# EAGLE board atmega_fusebit_doctor_V2_Custom_7 (EAGLE 8.5.1)
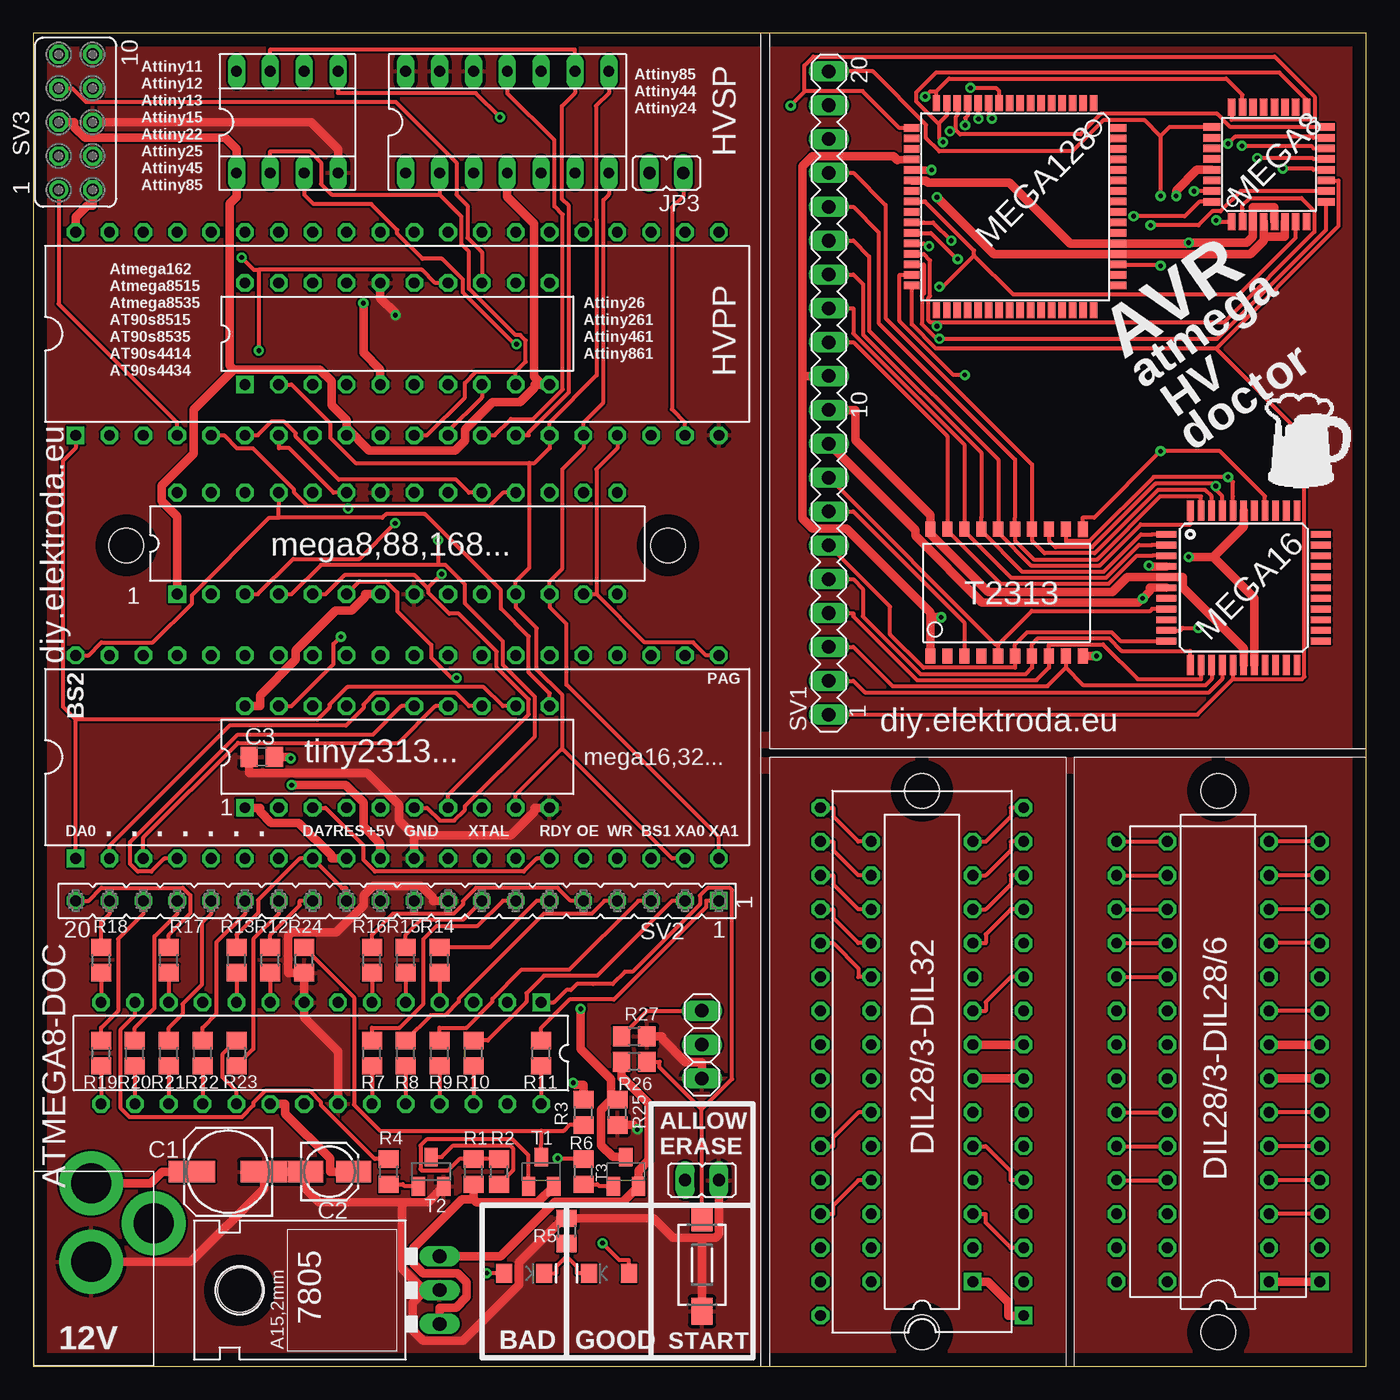
[diagram p3: board, top side]
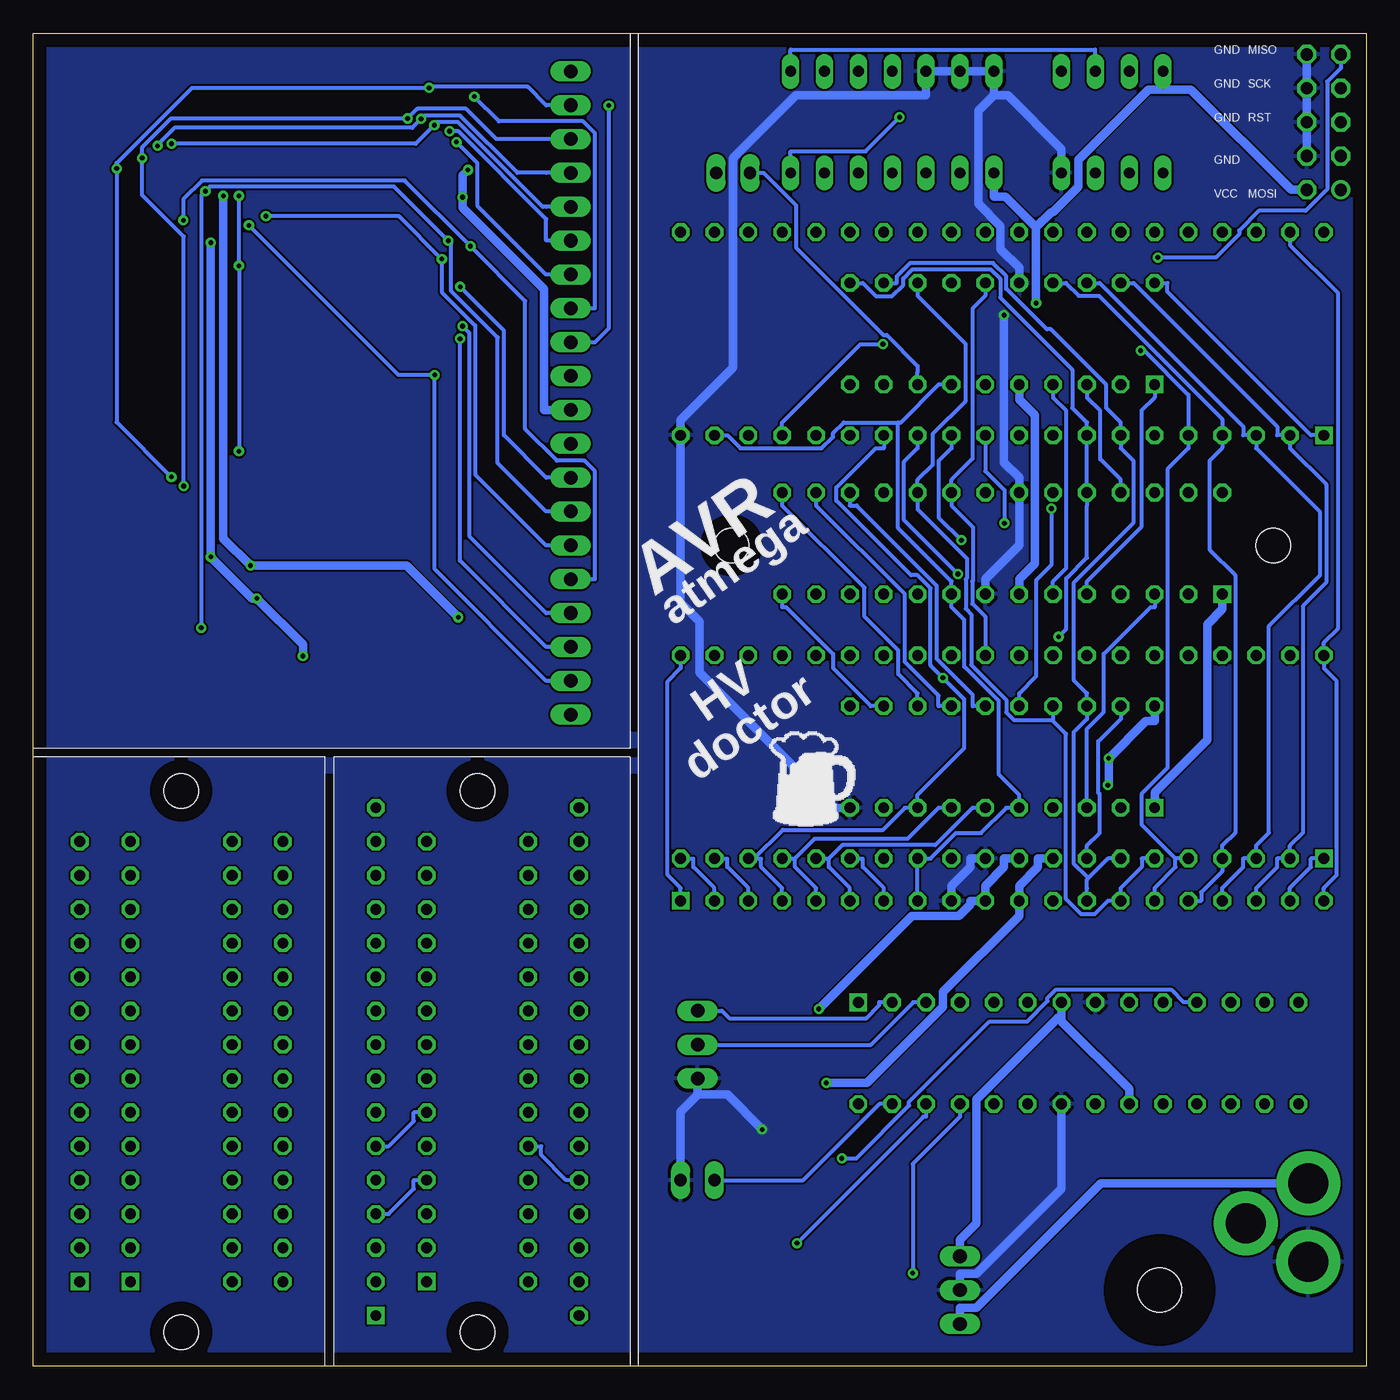
[diagram p4: board, bottom side, seen from below]

Size 100 x 100 mm. Coordinates in mm from the lower left corner, seen from the top.
Outline: 0,100 0,0 100,0 100,100 0,100
Copper layers (1*16): Top 0.035mm / dielectric 1.5mm / Bottom 0.035mm
Design rules "default": minimum track width 6mil, minimum drill 0.35mm, track to track 6mil, track to pad 6mil, pad to pad 6mil, via to via 6mil, smd to smd 6mil, copper to edge 40mil, drill to drill 6mil, minimum pad ring 10mil, minimum via ring 8mil, stop-mask expansion 4mil, vias tented up to drill 0mil, thermal gap 10mil
Net classes: 0 default: width 0.305 mm; 1 PWR: width 0.635 mm; 2 GND: width 0.635 mm
Holes 2.6 mm at 66.67,2.53 66.67,43.17 88.9,43.17 88.9,2.53 47.62,61.59 6.99,61.59

## Footprints (pad centres in the part's own frame; a part is rotated, then mirrored left to right if it is on the bottom)
153CLV-0605 = smd 3.5 x 1.6: + 2.7,0; - -2.7,0
153CLV-0405 = smd 2.6 x 1.6: + 1.8,0; - -1.8,0
C0805 = smd 1.3 x 1.5: 1 -0.95,0; 2 0.95,0
78XXL = drill 1.016 long: GND 0,-3.81; IN -2.54,-3.81; OUT 2.54,-3.81 | hole 3.302: 0,11.176
DIL28-3_OCT = drill 0.813 square: 1 -16.51,-3.81 | drill 0.813 octagon: 2 -13.97,-3.81; 3 -11.43,-3.81; 4 -8.89,-3.81; 5 -6.35,-3.81; 6 -3.81,-3.81; 7 -1.27,-3.81; 8 1.27,-3.81; 9 3.81,-3.81; 10 6.35,-3.81; 11 8.89,-3.81; 12 11.43,-3.81; 13 13.97,-3.81; 14 16.51,-3.81; 15 16.51,3.81; 16 13.97,3.81; 17 11.43,3.81; 18 8.89,3.81; 19 6.35,3.81; 20 3.81,3.81; 21 1.27,3.81; 22 -1.27,3.81; 23 -3.81,3.81; 24 -6.35,3.81; 25 -8.89,3.81; 26 -11.43,3.81; 27 -13.97,3.81; 28 -16.51,3.81
DIL40_OCT = drill 0.813 square: 1 -24.13,-7.62 | drill 0.813 octagon: 2 -21.59,-7.62; 3 -19.05,-7.62; 4 -16.51,-7.62; 5 -13.97,-7.62; 6 -11.43,-7.62; 7 -8.89,-7.62; 8 -6.35,-7.62; 9 -3.81,-7.62; 10 -1.27,-7.62; 11 1.27,-7.62; 12 3.81,-7.62; 13 6.35,-7.62; 14 8.89,-7.62; 15 11.43,-7.62; 16 13.97,-7.62; 17 16.51,-7.62; 18 19.05,-7.62; 19 21.59,-7.62; 20 24.13,-7.62; 21 24.13,7.62; 22 21.59,7.62; 23 19.05,7.62; 24 16.51,7.62; 25 13.97,7.62; 26 11.43,7.62; 27 8.89,7.62; 28 6.35,7.62; 29 3.81,7.62; 30 1.27,7.62; 31 -1.27,7.62; 32 -3.81,7.62; 33 -6.35,7.62; 34 -8.89,7.62; 35 -11.43,7.62; 36 -13.97,7.62; 37 -16.51,7.62; 38 -19.05,7.62; 39 -21.59,7.62; 40 -24.13,7.62
DIL20_OCT = drill 0.813 square: 1 -11.43,-3.81 | drill 0.813 octagon: 2 -8.89,-3.81; 3 -6.35,-3.81; 4 -3.81,-3.81; 5 -1.27,-3.81; 6 1.27,-3.81; 7 3.81,-3.81; 8 6.35,-3.81; 9 8.89,-3.81; 10 11.43,-3.81; 11 11.43,3.81; 12 8.89,3.81; 13 6.35,3.81; 14 3.81,3.81; 15 1.27,3.81; 16 -1.27,3.81; 17 -3.81,3.81; 18 -6.35,3.81; 19 -8.89,3.81; 20 -11.43,3.81
SOCKED-08 = drill 0.813 long: 1 -3.81,-3.81; 2 -1.27,-3.81; 3 1.27,-3.81; 4 3.81,-3.81; 5 3.81,3.81; 6 1.27,3.81; 7 -1.27,3.81; 8 -3.81,3.81
SOCKED-14 = drill 0.813 long: 1 -7.62,-3.81; 2 -5.08,-3.81; 3 -2.54,-3.81; 4 0,-3.81; 5 2.54,-3.81; 6 5.08,-3.81; 7 7.62,-3.81; 8 7.62,3.81; 9 5.08,3.81; 10 2.54,3.81; 11 0,3.81; 12 -2.54,3.81; 13 -5.08,3.81; 14 -7.62,3.81
TQFP32-08 = smd 1.27 x 0.559: 1 -4.293,2.8; 2 -4.293,2; 3 -4.293,1.2; 4 -4.293,0.4; 5 -4.293,-0.4; 6 -4.293,-1.2; 7 -4.293,-2; 8 -4.293,-2.8; 17 4.293,-2.8; 18 4.293,-2; 19 4.293,-1.2; 20 4.293,-0.4; 21 4.293,0.4; 22 4.293,1.2; 23 4.293,2; 24 4.293,2.8 | smd 0.559 x 1.27: 9 -2.8,-4.293; 10 -2,-4.293; 11 -1.2,-4.293; 12 -0.4,-4.293; 13 0.4,-4.293; 14 1.2,-4.293; 15 2,-4.293; 16 2.8,-4.293; 25 2.8,4.293; 26 2,4.293; 27 1.2,4.293; 28 0.4,4.293; 29 -0.4,4.293; 30 -1.2,4.293; 31 -2,4.293; 32 -2.8,4.293
DIL32 = drill 0.813 square: 1 -19.05,-7.62 | drill 0.813 octagon: 2 -16.51,-7.62; 3 -13.97,-7.62; 4 -11.43,-7.62; 5 -8.89,-7.62; 6 -6.35,-7.62; 7 -3.81,-7.62; 8 -1.27,-7.62; 9 1.27,-7.62; 10 3.81,-7.62; 11 6.35,-7.62; 12 8.89,-7.62; 13 11.43,-7.62; 14 13.97,-7.62; 15 16.51,-7.62; 16 19.05,-7.62; 17 19.05,7.62; 18 16.51,7.62; 19 13.97,7.62; 20 11.43,7.62; 21 8.89,7.62; 22 6.35,7.62; 23 3.81,7.62; 24 1.27,7.62; 25 -1.27,7.62; 26 -3.81,7.62; 27 -6.35,7.62; 28 -8.89,7.62; 29 -11.43,7.62; 30 -13.97,7.62; 31 -16.51,7.62; 32 -19.05,7.62
SO20L = smd 0.762 x 1.143: 1 -5.08,-5.131; 2 -3.81,-5.131; 3 -2.54,-5.131; 4 -1.27,-5.131; 5 0,-5.131; 6 1.27,-5.131; 7 2.54,-5.131; 8 3.81,-5.131; 9 5.08,-5.131; 10 6.35,-5.131; 11 6.35,4.369; 12 5.08,4.394; 13 3.81,4.394; 14 2.54,4.394; 15 1.27,4.394; 16 0,4.394; 17 -1.27,4.394; 18 -2.54,4.394; 19 -3.81,4.394; 20 -5.08,4.394
TQFP44 = smd 1.5 x 0.5: 1 -5.8,4; 2 -5.8,3.2; 3 -5.8,2.4; 4 -5.8,1.6; 5 -5.8,0.8; 6 -5.8,0; 7 -5.8,-0.8; 8 -5.8,-1.6; 9 -5.8,-2.4; 10 -5.8,-3.2; 11 -5.8,-4; 23 5.8,-4; 24 5.8,-3.2; 25 5.8,-2.4; 26 5.8,-1.6; 27 5.8,-0.8; 28 5.8,0; 29 5.8,0.8; 30 5.8,1.6; 31 5.8,2.4; 32 5.8,3.2; 33 5.8,4 | smd 0.5 x 1.5: 12 -4,-5.8; 13 -3.2,-5.8; 14 -2.4,-5.8; 15 -1.6,-5.8; 16 -0.8,-5.8; 17 0,-5.8; 18 0.8,-5.8; 19 1.6,-5.8; 20 2.4,-5.8; 21 3.2,-5.8; 22 4,-5.8; 34 4,5.8; 35 3.2,5.8; 36 2.4,5.8; 37 1.6,5.8; 38 0.8,5.8; 39 0,5.8; 40 -0.8,5.8; 41 -1.6,5.8; 42 -2.4,5.8; 43 -3.2,5.8; 44 -4,5.8
TQFP64 = smd 1.194 x 0.559: 1 -7.76,5.905; 2 -7.76,5.118; 3 -7.76,4.331; 4 -7.76,3.543; 5 -7.76,2.756; 6 -7.76,1.968; 7 -7.76,1.181; 8 -7.76,0.394; 9 -7.76,-0.394; 10 -7.76,-1.181; 11 -7.76,-1.968; 12 -7.76,-2.756; 13 -7.76,-3.543; 14 -7.76,-4.331; 15 -7.76,-5.118; 16 -7.76,-5.905; 33 7.76,-5.905; 34 7.76,-5.118; 35 7.76,-4.331; 36 7.76,-3.543; 37 7.76,-2.756; 38 7.76,-1.968; 39 7.76,-1.181; 40 7.76,-0.394; 41 7.76,0.394; 42 7.76,1.181; 43 7.76,1.968; 44 7.76,2.756; 45 7.76,3.543; 46 7.76,4.331; 47 7.76,5.118; 48 7.76,5.905 | smd 0.559 x 1.194: 17 -5.905,-7.76; 18 -5.118,-7.76; 19 -4.331,-7.76; 20 -3.543,-7.76; 21 -2.756,-7.76; 22 -1.968,-7.76; 23 -1.181,-7.76; 24 -0.394,-7.76; 25 0.394,-7.76; 26 1.181,-7.76; 27 1.968,-7.76; 28 2.756,-7.76; 29 3.543,-7.76; 30 4.331,-7.76; 31 5.118,-7.76; 32 5.905,-7.76; 49 5.905,7.76; 50 5.118,7.76; 51 4.331,7.76; 52 3.543,7.76; 53 2.756,7.76; 54 1.968,7.76; 55 1.181,7.76; 56 0.394,7.76; 57 -0.394,7.76; 58 -1.181,7.76; 59 -1.968,7.76; 60 -2.756,7.76; 61 -3.543,7.76; 62 -4.331,7.76; 63 -5.118,7.76; 64 -5.905,7.76
DIL28-6 = drill 0.813 square: 1 -16.51,-7.62 | drill 0.813 octagon: 2 -13.97,-7.62; 3 -11.43,-7.62; 4 -8.89,-7.62; 5 -6.35,-7.62; 6 -3.81,-7.62; 7 -1.27,-7.62; 8 1.27,-7.62; 9 3.81,-7.62; 10 6.35,-7.62; 11 8.89,-7.62; 12 11.43,-7.62; 13 13.97,-7.62; 14 16.51,-7.62; 15 16.51,7.62; 16 13.97,7.62; 17 11.43,7.62; 18 8.89,7.62; 19 6.35,7.62; 20 3.81,7.62; 21 1.27,7.62; 22 -1.27,7.62; 23 -3.81,7.62; 24 -6.35,7.62; 25 -8.89,7.62; 26 -11.43,7.62; 27 -13.97,7.62; 28 -16.51,7.62
JP1 = drill 0.914 long: 1 0,-1.27; 2 0,1.27
1X03 = drill 1.016 long: 1 -2.54,0; 2 0,0; 3 2.54,0
LED-1206 = smd 1.2 x 1.4: A -1.5,0; C 1.5,0
R0805 = smd 1.3 x 1.5: 1 -0.95,0; 2 0.95,0
DTSM-3 = smd 2 x 1.6: 1 -3.494,0; 2 3.494,0
MA20-1 = drill 1.016 long: 1 -24.13,0; 2 -21.59,0; 3 -19.05,0; 4 -16.51,0; 5 -13.97,0; 6 -11.43,0; 7 -8.89,0; 8 -6.35,0; 9 -3.81,0; 10 -1.27,0; 11 1.27,0; 12 3.81,0; 13 6.35,0; 14 8.89,0; 15 11.43,0; 16 13.97,0; 17 16.51,0; 18 19.05,0; 19 21.59,0; 20 24.13,0
FE20 = drill 0.813 square: 1 -24.13,0 | drill 0.813 octagon: 2 -21.59,0; 3 -19.05,0; 4 -16.51,0; 5 -13.97,0; 6 -11.43,0; 7 -8.89,0; 8 -6.35,0; 9 -3.81,0; 10 -1.27,0; 11 1.27,0; 12 3.81,0; 13 6.35,0; 14 8.89,0; 15 11.43,0; 16 13.97,0; 17 16.51,0; 18 19.05,0; 19 21.59,0; 20 24.13,0
FE05-2 = drill 0.914: 1 -5.08,1.27 | drill 0.914 octagon: 2 -5.08,-1.27; 3 -2.54,1.27; 4 -2.54,-1.27; 5 0,1.27; 6 0,-1.27; 7 2.54,1.27; 8 2.54,-1.27; 9 5.08,1.27; 10 5.08,-1.27
SOT23-BEC = smd 1 x 1.4: B -0.95,-1.1; C 0,1.1; E 0.95,-1.1
SOT23 = smd 1 x 1.4: 1 -0.95,-1.1; 2 0.95,-1.1; 3 0,1.1
PJ-102A = drill 3 pad 4.8: RING 0.1,-3.39; RING_SW -4.6,-6.29; TIP 0.1,-9.29

## Placement (x,y rotation side)
C1  100uF  [153CLV-0605]  14.61,14.59 180 top
C2  10uF  [153CLV-0405]  22.23,14.59 0 top
C3  10nF  [C0805]  17.14,45.71 180 top
IC1  7805  [78XXL]  26.67,5.71 90 top
IC2  ATMEGA8-DOC  [DIL28-3_OCT]  21.59,23.48 180 top
IC3  MEGA16/32/644...  [DIL40_OCT]  27.3,45.71 0 top
IC4  MEGA8/88/168...  [DIL28-3_OCT]  27.3,61.73 0 top
IC5  AT90S2313/TINY2313  [DIL20_OCT]  27.3,45.71 0 top
IC6  [SOCKED-08]  19.05,93.34 0 top
IC7  [SOCKED-14]  35.56,93.34 0 top
IC8  AT90S8515PDIL40_OCT  [DIL40_OCT]  27.3,77.46 0 top
IC9  TINY26  [DIL20_OCT]  27.3,77.46 0 top
IC10  MEGA8/88/168...  [DIL28-3_OCT]  66.67,22.85 90 top
IC11  MEGA8-AI  [TQFP32-08]  92.71,90.16 90 top
IC13  [DIL32]  66.67,22.85 90 top
IC14  TINY2313  [SO20L]  72.39,58.41 0 top
IC15  MEGA16  [TQFP44]  90.81,58.41 0 top
IC16  MEGA128-A  [TQFP64]  73.66,86.98 270 top
IC17  MEGA8/88/168...  [DIL28-3_OCT]  88.9,22.85 90 top
IC18  [DIL28-6]  88.9,22.85 90 top
JP1  ERASE  [JP1]  50.16,13.96 90 top
JP2  RS232  [1X03]  50.16,24.12 90 top
JP3  HVSP  [JP1]  47.5,89.53 90 top
LED1  red  [LED-1206]  36.83,6.97 0 top
LED2  green  [LED-1206]  43.18,6.97 180 top
R1  10K  [R0805]  33.02,14.59 90 top
R2  1K  [R0805]  34.92,14.59 270 top
R3  100  [R0805]  41.27,19.04 90 top
R4  4K7  [R0805]  26.67,14.59 90 top
R5  330  [R0805]  40.01,10.15 270 top
R6  4K7  [R0805]  41.27,14.59 90 top
R7  1K  [R0805]  25.4,23.48 90 top
R8  1K  [R0805]  27.94,23.48 90 top
R9  1K  [R0805]  30.48,23.48 90 top
R10  1K  [R0805]  33.02,23.48 90 top
R11  1K  [R0805]  38.1,23.48 90 top
R12  1K  [R0805]  17.78,30.47 90 top
R13  1K  [R0805]  15.24,30.47 90 top
R14  1K  [R0805]  30.48,30.47 90 top
R15  1K  [R0805]  27.94,30.47 90 top
R16  1K  [R0805]  25.4,30.47 90 top
R17  1K  [R0805]  10.16,30.47 90 top
R18  1K  [R0805]  5.08,30.47 90 top
R19  1K  [R0805]  5.08,23.48 90 top
R20  1K  [R0805]  7.62,23.48 90 top
R21  1K  [R0805]  10.16,23.48 90 top
R22  1K  [R0805]  12.7,23.48 90 top
R23  1K  [R0805]  15.24,23.48 270 top
R24  1K  [R0805]  20.32,30.47 90 top
R25  100  [R0805]  43.81,19.04 90 top
R26  1K  [R0805]  45.09,22.85 180 top
R27  10K  [R0805]  45.09,24.75 0 top
START  DTSM-3  [DTSM-3]  50.16,7.61 90 top
SV1  [MA20-1]  59.69,73.02 90 top
SV2  [FE20]  27.3,34.91 180 top
SV3  [FE05-2]  3.17,93.34 90 top
T1  BC857  [SOT23-BEC]  38.1,14.59 0 top
T2  BC847  [SOT23]  29.84,14.59 0 top
T3  BC557  [SOT23-BEC]  44.45,14.59 0 top
U$3  2.1MMJACKTHM  [PJ-102A]  4.45,4.44 180 top

## Tracks (layer width: path | path; a pad name or v marks a point on that pad's centre or on a via)
1
  Top 0.305: IC13.5 73.33,13.96 73.33,14.62 71.45,16.5 IC10.5
2
  Bottom 0.305: IC10.6 71.45,19.04 71.45,18.38 73.33,16.5 IC13.6
3
  Top 0.635: IC18.1 IC17.1
4
  Top 0.635: IC13.8 IC10.7
5
  Top 0.635: IC13.9 IC10.8
7
  Top 0.305: IC10.9 71.45,26.66 71.45,27.32 73.33,29.2 IC13.11
9
  Top 0.305: IC10.11 71.45,31.74 71.45,32.4 73.33,34.28 IC13.13
10
  Top 0.305: IC13.14 73.33,36.82 73.33,36.16 71.45,34.28 IC10.12
11
  Top 0.305: IC13.15 73.33,39.36 73.33,38.7 71.45,36.82 IC10.13
12
  Top 0.305: IC13.16 73.33,41.9 73.33,41.24 71.45,39.36 IC10.14
13
  Top 0.305: IC13.17 60.02,41.9 60.02,41.24 61.9,39.36 IC10.15
14
  Top 0.305: IC13.18 60.02,39.36 60.02,38.7 61.9,36.82 IC10.16
15
  Top 0.305: IC13.19 60.02,36.82 60.02,36.16 61.9,34.28 IC10.17
16
  Top 0.305: IC13.20 60.02,34.28 60.02,33.62 61.9,31.74 IC10.18
17
  Top 0.305: IC10.19 61.9,29.2 61.9,29.86 60.02,31.74 IC13.21
19
  Top 0.305: IC18.3 IC17.3
20
  Top 0.305: IC18.4 IC17.4
21
  Top 0.305: IC18.5 IC17.5
22
  Top 0.305: IC18.6 IC17.6
23
  Top 0.305: IC13.27 60.02,16.5 60.02,17.16 61.9,19.04 IC10.23
24
  Bottom 0.305: IC10.24 61.9,16.5 61.9,15.84 60.02,13.96 IC13.28
25
  Top 0.305: IC13.29 60.02,11.42 60.02,12.08 61.9,13.96 IC10.25
29
  Top 0.635: IC13.1 73.17,3.8 73.17,4.79 71.61,6.34 IC10.1
31
  Top 0.305: IC10.3 71.45,11.42 71.45,10.76 73.33,8.88 IC13.3
32
  Bottom 0.305: IC10.4 71.45,13.96 71.45,13.3 73.33,11.42 IC13.4
33
  Top 0.635: IC18.7 IC17.7
34
  Top 0.635: IC18.8 IC17.8
35
  Top 0.305: IC18.9 IC17.9
37
  Top 0.305: IC18.11 IC17.11
38
  Top 0.305: IC18.12 IC17.12
39
  Top 0.305: IC18.13 IC17.13
40
  Top 0.305: IC18.14 IC17.14
41
  Top 0.305: IC18.15 IC17.15
42
  Top 0.305: IC18.16 IC17.16
43
  Top 0.305: IC18.17 IC17.17
44
  Top 0.305: IC18.18 IC17.18
45
  Top 0.305: IC18.19 IC17.19
47
  Top 0.305: IC18.23 IC17.23
48
  Top 0.305: IC18.24 IC17.24
49
  Top 0.305: IC18.25 IC17.25
+5V  (via drill 0.35 pad 0.76)
  Top 0.635: IC3.10 26.04,39.22 24.77,40.49 24.77,42.28 23.45,43.59 v19.38,43.59 | v24.77,79.76 24.77,76.05 26.04,74.78 IC9.5 | SV3.2 4.45,87.07 4.04,87.07 3.17,86.21 IC8.40 | T3.C 43.48,15.7 42.59,16.58 42.59,19.24 43.35,19.99 | 43.35,19.99 43.35,21.52 41.07,23.8 v41.07,26.81 | R25.2 43.35,19.99 | IC4.7 24.91,57.92 24.91,57.71 23.89,56.69 22.66,56.69 19.68,53.71 19.68,53 17,50.32 17,49.52 IC5.20 | C3.1 19.21,45.71 v19.32,45.6
  Bottom 0.635: v19.38,43.59 19.32,43.65 v19.32,45.6 16.54,48.39 15.88,48.39 IC5.20 | IC9.5 26.04,72.52 24.88,71.36 24.88,60.21 26.04,59.05 IC4.7 | 24.77,85.44 v24.77,79.76 | SV3.2 5.63,88.26 13.15,95.78 15.24,95.78 | 24.77,85.44 23.61,86.59 23.51,86.59 21.59,88.51 21.59,90.53 16.34,95.78 15.24,95.78 | 24.77,85.44 27.06,87.73 27.94,87.73 IC7.1 | IC6.8 15.24,95.78 | v41.07,26.81 34.09,33.79 30.55,33.79 29.7,34.63 29.7,34.91 SV2.10 28.57,36.05 27.16,37.45 27.16,38.09 IC3.10
+5V*  (via drill 0.35 pad 0.76)
  Top 0.559: 67.38,89.74 IC16.21 | IC16.52
  Top 0.635: 92.31,84.76 92.31,84.44 91.32,83.44 IC16.52 72.05,83.44 v67.79,87.71 | 67.38,89.74 67.39,89.75 v67.39,89.75 | SV1.10 61.68,71.75 61.68,69.47 67.31,63.85 IC14.20 67.31,62.44 71.67,58.08 80.95,58.08 82.08,59.21 83.78,59.21 IC15.5 86.22,59.21 86.22,58.41 90.81,53.83 IC15.17 | IC11.4 92.31,84.76 | 92.31,84.76 93.91,84.76 IC11.6
  Bottom 0.635: v67.39,89.75 67.79,89.35 v67.79,87.71 67.79,86.92 61.68,80.81 61.68,71.75 SV1.10
+12V  (via drill 0.35 pad 0.76)
  Top 0.635: 38.17,73.65 37.56,74.26 37.56,85.74 35.56,87.73 IC7.4 | 38.17,73.65 37.6,73.65 37.6,73.42 36.51,72.32 34.44,72.32 32.38,70.26 32.38,69.45 31.64,68.7 25.2,68.7 23.5,70.41 | IC9.10 38.17,73.65 | 23.5,70.41 23.5,70.97 22.36,72.1 22.36,73.9 21.48,74.78 15.02,74.78 | IC8.9 23.5,70.41 | IC3.9 22.36,38.09 22.36,38.32 19.92,40.77 17.85,40.77 17,41.62 17,41.9 IC5.1 | R3.2 41.27,21.11 40.66,21.11 v40.51,21.26 | 15.02,74.78 14.74,75.06 14.74,87.24 15.24,87.73 IC6.1 15.24,91.32 14.4,92.15 3.9,92.15 3.09,92.97 3.09,93.34 SV3.5 | IC4.1 10.79,63.74 9.62,64.92 9.62,66.06 12.03,68.47 12.03,71.79 15.02,74.78
  Bottom 0.635: IC5.1 15.88,43.03 11.93,46.98 11.93,55.66 10.79,56.79 IC4.1 | IC3.9 24.62,38.09 24.62,37.45 26.04,36.05 SV2.11 26.04,33.79 31.75,28.07 31.75,26.96 37.45,21.26 v40.51,21.26
+12V*  (via drill 0.35 pad 0.76)
  Top 0.559: IC16.20 64.87,90.53 64.83,90.49
  Top 0.635: 64.83,90.49 64.53,90.8 58.44,90.8 57.7,90.05 57.7,74.29 | SV1.11 57.7,74.29 | 67.31,56.19 IC14.1 | v68.12,56.19 67.31,56.19 | 57.7,74.29 57.7,63.6 58.44,62.85 61,62.85 67.31,56.54 67.31,56.19 | v85.74,87.8 85.74,88.19 87.31,89.76 IC11.29 | IC15.4 83.76,60.01 v83.7,60.07
  Bottom 0.635: v85.74,87.8 85.74,62.11 v83.7,60.07 71.99,60.07 v68.12,56.19
AVCC
  Bottom 0.305: IC3.30 28.57,56.23 29.56,57.21 29.56,58.9 29.49,58.96 29.49,62.95 31.11,64.58 IC4.20 31.11,66.51 29.54,68.08 29.54,79.34 28.57,80.31 IC9.15
BS1  (via drill 0.35 pad 0.76)
  Top 0.305: IC4.6 24.46,58.89 26.47,58.89 27.3,58.05 27.3,56.65 29.84,54.11 29.84,53.17 31.37,51.64 v31.76,51.64 | SV2.4 42.85,34.91 41.88,33.95 38.29,33.95 31.91,27.57 31.91,27.35 30.89,26.33 29.84,26.33 R8.2 | IC8.14 37.16,69.84 37.16,70.06 40.18,73.08 40.18,87.06 39.67,87.57 39.67,94.55 40.64,95.52 IC7.9 40.64,98.77 17.78,98.77 IC6.7
  Bottom 0.305: IC8.14 36.2,68.88 36.79,68.88 39.74,65.92 39.74,64.94 34.15,59.34 33.67,59.34 32.69,58.37 32.69,52.57 v31.76,51.64 30.15,50.03 30.15,46.37 33.66,42.87 IC5.8 34.62,41.9 36.27,40.25 43.77,40.25 45.93,38.09 | IC3.18 45.93,38.09 | 45.93,38.09 45.87,38.09 45.39,38.09 45.39,37.45 43.81,35.88 SV2.4 | IC4.6 23.5,58.88 22.5,59.88 22.5,71.69 23.5,72.69 IC9.4
BS1*  (via drill 0.35 pad 0.76)
  Top 0.305: IC11.2 90.71,86.81 90.71,87.09 91.26,87.64 95.14,87.64 96.12,86.66 96.12,85.12 89.3,78.3 67.8,78.3 | 67.8,78.3 67.32,78.3 67.17,78.45 67.17,80.17 67.29,80.29 67.29,82.96 66.8,83.44 IC16.29 | 67.8,78.3 v67.8,78.03 | SV1.4 61.52,56.51 61.52,56.26 66.31,51.47 75.27,51.47 76.2,52.4 IC14.8 76.2,54.16 80.25,54.16 82.86,51.55 87.61,51.55 IC15.13
  Bottom 0.305: v67.8,78.03 67.3,77.54 67.3,62.29 61.52,56.51 SV1.4
BS2
  Top 0.305: 18.41,63.65 26.19,63.65 26.46,63.93 29.38,63.93 35.09,58.22 35.09,56.84 37.17,54.76 37.17,52.05 38.73,50.48 IC5.11 | 18.41,63.65 17.7,63.65 11.9,57.85 11.9,57.23 8.97,54.3 5.11,54.3 4.14,53.33 IC3.40 | 18.41,63.65 18.41,64.58 IC4.25 | R17.2 10.16,32.38 11.77,33.99 11.77,35.33 11.22,35.88 5.11,35.88 4.14,34.91 SV2.20
  Bottom 0.305: IC9.3 20.95,72.69 19.96,71.69 19.96,68.05 18.41,66.51 IC4.25 | SV2.20 3.17,35.88 2.21,36.85 2.21,51.4 3.17,52.37 IC3.40 3.17,54.3 2.15,55.32 2.15,80.55 5.71,84.12 IC8.39
BS2*  (via drill 0.35 pad 0.76)
  Top 0.305: IC14.11 78.74,63.66 79.59,63.66 v84.57,68.64 89.03,68.64 92.41,65.27 IC15.37 | 84.57,92.29 v84.57,87.8 | 84.57,92.29 83.39,93.48 80.27,93.48 77.95,91.15 67.97,91.15 66.99,92.14 66.99,93.14 62.98,97.15 SV1.20 | 84.57,92.29 85.24,92.96 87.48,92.96 IC11.25 | IC16.51 84.48,82.65 v84.57,82.56
  Bottom 0.305: v84.57,87.8 v84.57,82.56 v84.57,68.64
DATA0
  Top 0.305: 3.17,48.51 21.32,48.51 22.23,49.42 22.23,49.63 23.55,50.95 33.8,50.95 35.23,49.52 IC5.12 | 3.17,48.51 2.21,49.48 2.21,67.91 3.17,68.88 IC8.1 | 3.17,48.51 3.17,39.05 IC3.1 | SV2.19 5.71,33.95 5.08,33.31 R18.2
  Bottom 0.305: IC9.20 14.91,81.27 14.91,80.61 4.14,69.84 IC8.1 | IC3.1 4.14,38.09 4.14,37.45 5.71,35.88 SV2.19 | IC5.12 37.16,49.52 40.01,52.37 40.01,53.44 43.52,56.95 43.81,56.95 IC4.14
DATA0*  (via drill 0.35 pad 0.76)
  Top 0.305: IC14.12 77.47,61.93 77.5,61.9 79.25,61.9 84.06,66.72 v89.64,66.72 90,66.35 90,65.27 IC15.40 | v93.75,89.86 95.97,89.86 96.06,89.76 IC11.12 | v70.3,95.91 72.22,95.91 72.48,95.65 IC16.10
  Bottom 0.305: v89.64,66.72 93.75,70.82 v93.75,89.86 93.75,90.26 88.1,95.91 v70.3,95.91 70.24,95.98 62.89,95.98 61.52,94.61 SV1.19
DATA1
  Top 0.305: IC3.2 5.71,39.05 14.71,48.05 23.45,48.05 24.77,49.37 24.77,49.63 25.62,50.49 31.72,50.49 32.69,49.52 IC5.13 | R19.2 5.08,25.39 6.35,26.66 6.35,32.05 8.26,33.95 SV2.18
  Bottom 0.305: SV2.18 8.26,35.88 6.68,37.45 6.68,38.09 IC3.2 5.71,39.05 4.75,40.02 4.75,57.03 3,58.78 3,66.16 5.71,68.88 IC8.2 6.68,69.84 6.68,70.5 17.45,81.27 IC9.19 | IC4.15 43.81,64.58 37.64,58.4 37.64,56.24 35.1,53.7 35.1,51.93 33.66,50.48 IC5.13
DATA1*  (via drill 0.35 pad 0.76)
  Top 0.305: IC14.13 76.2,61.93 76.68,61.45 79.44,61.45 84.19,66.2 88.54,66.2 v88.72,66.03 88.72,65.75 89.2,65.27 IC15.41 | v71.92,93.62 71.69,93.84 IC16.11 | IC11.13 96.06,90.56 95.98,90.64 v91.83,90.64
  Bottom 0.305: v88.72,66.03 88.72,84.75 91.83,87.85 v91.83,90.64 91.83,91.45 89.67,93.62 v71.92,93.62 71.2,94.33 67.52,94.33 65.25,92.07 61.52,92.07 SV1.18
DATA2
  Top 0.305: IC5.14 30.15,49.52 27.39,46.77 15.36,46.77 8.26,39.66 IC3.3 | SV2.17 10.79,33.95 9.11,32.26 9.11,26.88 7.62,25.39 R20.2
  Bottom 0.305: SV2.17 10.79,35.88 9.22,37.45 9.22,38.09 IC3.3 8.26,39.05 7.29,40.02 7.29,55.52 3.46,59.34 3.46,64.08 8.26,68.88 IC8.3 9.22,69.84 9.22,70.5 19.99,81.27 IC9.18 | IC4.16 41.27,64.58 34.62,57.92 34.62,52.84 32.08,50.3 32.08,49.52 IC5.14
DATA2*  (via drill 0.35 pad 0.76)
  Top 0.305: SV1.17 61.52,89.53 63.94,87.11 63.94,78.64 74.93,67.65 IC14.14 74.93,61.93 75.87,60.99 79.63,60.99 84.38,65.75 87.92,65.75 88.41,65.27 IC15.42 | IC11.14 96.06,91.36 95.86,91.56 v90.68,91.56 | v70.9,93.58 IC16.12
  Bottom 0.305: v90.68,91.56 90.68,91.64 89.4,92.92 71.57,92.92 v70.9,93.58 70.65,93.83 67.99,93.83 63.68,89.53 61.52,89.53 SV1.17
DATA3
  Top 0.305: IC8.4 10.79,70.81 1.91,79.7 SV3.1 | IC5.15 27.61,49.52 25.48,47.39 15.34,47.39 7.27,39.32 7.27,37.69 7.84,37.12 8.86,37.12 9.83,38.09 IC3.4 | R21.2 10.16,25.39 11.19,26.42 11.19,27.17 12.64,28.62 12.64,33.26 13.34,33.95 SV2.16
  Bottom 0.305: IC4.17 38.73,64.58 38.24,64.58 32.23,58.57 32.23,53.08 29.54,50.39 29.54,49.52 IC5.15 | SV2.16 12.37,34.91 12.37,35.55 10.79,37.12 IC3.4 10.79,39.05 9.83,40.02 9.83,59.35 11.76,61.29 11.76,67.91 10.79,68.88 IC8.4 10.79,71.05 20.05,80.31 21.56,80.31 22.53,81.27 IC9.17
DATA3*  (via drill 0.35 pad 0.76)
  Top 0.305: IC11.15 96.06,92.16 95.98,92.24 90.16,92.24 v89.63,91.71 | IC15.43 87.61,65.27 84.55,65.27 79.82,60.53 75.06,60.53 73.66,61.93 IC14.15 73.66,62.84 73.66,63.68 73.66,68.04 63.42,78.27 63.42,85.08 61.52,86.98 SV1.16 | v69.91,93.11 69.91,93.64 70.12,93.84 IC16.13 | v69.91,93.11
  Bottom 0.305: v89.63,91.71 71.31,91.71 v69.91,93.11 69.69,93.34 68.14,93.34 61.79,86.98 61.52,86.98 SV1.16
DATA4  (via drill 0.35 pad 0.76)
  Top 0.305: 23.62,64.56 34.25,64.56 35.23,65.54 IC4.18 | 23.62,64.56 20.56,64.56 19.53,65.59 19.53,65.8 16.46,68.88 15.27,68.88 14.3,69.84 IC8.5 | 23.62,64.56 v23.62,64.34 | R22.2 12.7,25.39 13.73,26.42 13.73,31.8 15.88,33.95 SV2.15 | 16.92,82.26 v16.92,76.19 | v15.63,83.18 16.54,82.26 16.92,82.26 | 16.92,82.26 29.16,82.26 30.15,81.27 IC9.14
  Bottom 0.305: IC5.16 26.04,50.48 24.77,51.76 24.77,58.96 23.62,60.1 v23.62,64.34 | SV2.15 15.88,35.88 14.3,37.45 14.3,38.09 | IC3.5 14.3,38.09 | 14.3,38.09 16.87,40.66 16.87,42.93 14.9,44.89 14.9,67.31 13.34,68.88 IC8.5 13.34,72.87 16.66,76.19 v16.92,76.19 | v15.63,83.18 11.27,83.18 9.53,84.92 9.53,85.19 8.04,86.68 4.54,86.68 2.92,88.3 2.92,96.38 1.91,97.4 SV3.9
DATA4*  (via drill 0.35 pad 0.76)
  Top 0.305: SV1.15 61.52,84.45 62.71,83.25 62.71,77.69 72.39,68.01 IC14.16 72.39,62.54 74.86,60.07 80,60.07 83.09,63.16 86.81,63.16 IC15.44 | IC11.16 89.82,92.96 88.82,93.96 80.11,93.96 78.57,92.43 69.53,92.43 69.19,92.76 | 69.19,92.76 68.88,92.76 v68.77,92.65 | 69.19,92.76 69.19,93.7 69.33,93.84 IC16.14
  Bottom 0.305: v68.77,92.65 68.1,92.65 61.52,86.07 61.52,84.45 SV1.15
DATA5
  Top 0.305: IC8.6 16.84,69.84 17.85,70.85 18.83,70.85 19.68,70 19.68,69.73 22.91,66.51 31.72,66.51 32.69,65.54 IC4.19 | SV3.7 2.92,95.88 3.94,94.86 27.19,94.86 31.75,90.3 31.75,87.9 32.58,87.07 32.58,84.65 33.66,83.57 IC9.13 | SV2.14 18.41,33.95 16.51,32.05 16.51,23.8 R23.2
  Bottom 0.305: 23.57,48.48 26.42,48.48 27,49.05 27,49.98 29.64,52.62 29.64,56.41 30.05,56.83 30.05,59.05 29.95,59.15 29.95,60.58 33.66,64.29 33.66,64.58 IC4.19 33.66,66.51 32.54,67.62 32.54,69.92 30.07,72.38 30.07,76.72 33.66,80.31 IC9.13 | 23.57,48.48 22.53,47.44 22.53,35.06 21.37,33.9 20.39,33.9 19.38,34.91 SV2.14 18.41,35.88 16.84,37.45 16.84,38.09 IC3.6 | 23.57,48.48 23.5,48.55 IC5.17
DATA5*  (via drill 0.35 pad 0.76)
  Top 0.305: 83.95,62.41 83.11,62.41 80.31,59.62 74.18,59.62 71.12,62.68 IC14.17 71.12,62.84 71.12,63.68 71.12,68.53 62.26,77.39 62.26,81.17 61.52,81.91 SV1.14 | 83.95,62.41 | IC11.17 95.51,95.03 93.48,97.06 67.73,97.06 66.22,95.55 66.22,94.9 67.87,93.25 67.95,93.25 | IC15.1 83.95,62.41 | 67.95,93.25 67.95,92.14 v68.25,91.84 | 67.95,93.25 68.54,93.84 IC16.15
  Bottom 0.305: v68.25,91.84 66.7,90.28 66.7,87.08 61.52,81.91 SV1.14
DATA6
  Top 0.305: IC8.7 18.41,68.88 19.2,68.88 22.53,65.54 IC4.23 | SV2.13 19.99,34.91 19.99,34.59 17.78,32.38 R12.2
  Bottom 0.305: 20.86,36.61 19.38,38.09 IC3.7 | 20.86,36.61 20.95,36.52 20.95,35.88 SV2.13 | 20.86,36.61 21.93,37.69 21.93,47.58 20.95,48.55 IC5.18 20.95,50.48 21.93,51.46 21.93,58.81 17.44,63.3 17.44,67.9 18.41,68.88 IC8.7 18.41,70.81 19.5,71.89 19.5,73.63 23.66,77.79 23.95,77.79 27,80.84 27,81.77 27.99,82.76 34.23,82.76 35.23,81.76 35.23,81.27 IC9.12
DATA6*  (via drill 0.35 pad 0.76)
  Top 0.305: 67.75,95.65 68.71,96.6 89.5,96.6 90.71,95.39 IC11.23 | v66.92,95.26 67.3,95.65 67.75,95.65 | IC16.16 67.75,95.65 | IC15.2 83.95,61.61 82.95,61.61 80.5,59.16 73.36,59.16 69.85,62.67 IC14.18 69.85,69.15 61.52,77.48 61.52,79.37 SV1.13
  Bottom 0.305: SV1.13 57.86,79.37 57.86,92.51 58.75,93.4 65.06,93.4 v66.92,95.26
DATA7  (via drill 0.35 pad 0.76)
  Top 0.305: IC5.19 19.38,49.52 22.53,52.67 22.53,54.18 v23.07,54.73 | SV2.12 23.5,35.88 23.16,35.88 IC3.8 19.99,38.09 16.86,34.97 16.86,34 15.24,32.38 R13.2
  Bottom 0.305: IC5.19 18.41,48.55 20.1,46.87 20.1,43.04 19.99,42.93 19.99,40.02 20.95,39.05 IC3.8 | v23.07,54.73 22.5,55.3 22.5,59.11 20.95,60.66 20.95,64.58 IC4.24 IC8.8 20.95,70.81 22.04,71.9 22.04,74.76 27.46,80.18 27.46,81.58 28.18,82.3 34.04,82.3 34.73,81.61 34.73,81.12 35.58,80.27 36.77,80.27 37.77,81.27 IC9.11
DATA7*  (via drill 0.35 pad 0.76)
  Top 0.305: 57.85,95.67 57.85,97.57 58.53,98.25 93.12,98.25 96.13,95.25 96.13,93.7 95.94,93.51 89.91,93.51 IC11.24 | v56.82,94.58 57.85,95.6 57.85,95.67 | 57.85,95.67 62.22,95.67 65,92.89 IC16.17 | SV1.12 61.52,76.83 68.58,69.76 IC14.19 68.58,62.68 72.56,58.7 80.69,58.7 82.8,60.81 83.95,60.81 IC15.3
  Bottom 0.305: SV1.12 57.86,76.83 56.82,77.86 v56.82,94.58
GND  (via drill 0.35 pad 0.76)
  Top 0.635: v27.18,78.86 27.18,79 26.04,80.14 IC9.16 | SV2.9 29.98,34.91 29.98,35.15 29.09,36.05 25.5,36.05 24.77,35.31 24.77,34.57 22.73,32.54 19.37,32.54 19.1,32.27 19.1,29.52 R24.1 IC2.8 20.32,26.16 22.86,23.62 IC2.22 | U$3.RING 11.8,7.83 17.3,13.32 C1.- C2.- 20.43,13.32 21.45,12.3 27.67,12.3 | R25.1 45.03,18.09 45.03,18.04 v45.32,17.76 | 29.34,5.65 28.45,4.76 28.45,2.68 29.23,1.91 32.25,1.91 36.46,6.12 36.46,7.8 39.76,11.1 R5.1 46.51,11.1 47.98,9.63 50.16,9.63 | 29.34,5.65 29.4,5.71 29.48,5.71 IC1.GND | 27.67,12.3 27.67,7.32 29.34,5.65 | 27.67,12.3 29.6,12.3 T2.2 | IC6.4 22.86,91.32 20.84,93.34 SV3.6 | JP2.1 50.16,22.81 48.93,22.81 47.16,24.59 47.16,24.75 R27.2 | IC5.10 37.6,41.9 37.6,41.62 35.8,39.82 28.57,39.82 | C3.2 16.2,44.49 25.06,44.49 27.45,42.1 27.45,40.95 28.57,39.82 | JP1.1 51.44,9.9 51.17,9.63 50.16,9.63 | 50.16,9.63 START.1 | IC3.11 28.57,39.82
  Bottom 0.635: v27.18,78.86 27.18,67.81 26.04,66.67 IC4.22 26.04,64.41 26.04,61.59 28.57,59.05 IC4.8 | IC5.10 39.87,41.9 50.03,52.06 50.03,55.87 51.44,57.28 IC8.20 51.44,70.97 47.5,74.91 47.5,90.64 42.78,95.35 33.02,95.35 IC7.12 IC7.13 IC7.14 27.94,96.25 27.94,95.35 | 50.16,20.38 47.94,20.38 v45.32,17.76 | 50.16,20.38 50.16,20.35 51.44,19.08 JP1.1 | 50.16,20.38 50.16,20.41 50.16,20.58 JP2.1 | IC2.22 22.86,18.55 22.86,13.32 29.25,6.94 30.48,6.94 IC1.GND | IC9.16 26.04,82.4 27.45,83.81 27.45,85.55 29.1,87.2 29.1,94.19 27.94,95.35 | IC3.11 29.7,38.09 29.7,37.45 31.11,36.05 SV2.9 | IC6.4 22.86,91.32 26.9,95.35 27.94,95.35 | SV3.4 SV3.6 SV3.8 SV3.10
  pour Top: 0,0 0,100 100,100 100,0
  pour Bottom: 0,0 0,100 100,100 100,0
  cutout Bottom: 54.61,46.34 99.06,46.34 99.06,45.71 54.61,45.71
  cutout Bottom: 54.61,0.62 55.24,0.62 55.24,44.44 54.61,44.44
  cutout Bottom: 77.47,0.62 78.11,0.62 78.11,44.44 77.47,44.44
  cutout Bottom: 54.61,99.69 55.24,99.69 55.24,47.62 54.61,47.62
  cutout Top: 54.61,99.69 55.24,99.69 55.24,47.62 54.61,47.62
  cutout Top: 54.61,0.62 55.24,0.62 55.24,44.44 54.61,44.44
  cutout Top: 77.47,0.62 78.11,0.62 78.11,44.44 77.47,44.44
  cutout Top: 54.61,45.71 54.61,46.34 99.69,46.34 99.69,45.71
GND*  (via drill 0.35 pad 0.76)
  Top 0.635: SV1.9 66.17,62.72 66.17,62.3 71.18,57.29 82.92,57.29 v83.23,57.61 83.78,58.16 83.78,58.41 IC15.6 | 88.53,60.71 v86.68,60.71 | 88.53,60.71 90.81,62.99 IC15.39 | 88.53,60.71 91.61,57.64 IC15.18 | IC14.10 v79.77,53.28 | IC16.22 66.97,88.95 67.12,88.81 73.22,88.81 77.8,84.23 IC16.53 86.61,84.23 v86.68,84.3 91.05,84.3 91.51,84.76 IC11.3 91.51,86.97 93.11,86.97 IC11.5
  Bottom 0.635: v86.68,84.3 v86.68,60.71 83.58,57.61 v83.23,57.61 79.77,54.15 v79.77,53.28
N$1
  Top 0.305: R6.1 42.33,13.64 42.48,13.5 T3.B
N$2
  Top 0.305: R18.1 IC2.14
N$3
  Bottom 0.305: IC2.3 33.98,27.29 37.16,24.12 JP2.2
N$4
  Top 0.305: R11.1 IC2.28
N$5
  Top 0.305: R16.1 IC2.6
N$6
  Top 0.305: R14.1 IC2.4
N$7
  Top 0.305: R27.1 46.04,26.66 JP2.3
  Bottom 0.305: IC2.2 36.52,27.29 36.52,27.09 37.51,26.11 47.78,26.11 48.34,26.66 JP2.3
N$8
  Top 0.305: T2.3 30.65,15.7 31.51,16.55 35.78,16.55 35.98,16.35 35.98,14.7 R2.2
N$9
  Top 0.305: R12.1 IC2.9
N$10
  Top 0.305: R13.1 IC2.10
N$11
  Top 0.305: IC2.13 7.62,26.33 6.57,25.27 6.57,19.34 7.22,18.69 15.64,18.69 16.51,19.56 16.51,19.77 17.38,20.64 20.76,20.64 21.59,19.81 21.59,19.57 25.61,15.55 R4.2
N$12  (via drill 0.35 pad 0.76)
  Top 0.305: R6.2 39.39,15.55 v39.34,15.59
  Bottom 0.305: IC2.11 13.66,27.29 14.63,28.26 23.27,28.26 23.9,27.63 23.9,27.39 25.43,25.86 28.27,25.86 34.29,19.83 34.29,19.56 38.26,15.59 v39.34,15.59
N$14
  Top 0.305: R19.1 IC2.15
N$16
  Top 0.305: R20.1 IC2.16
N$19
  Top 0.305: R15.1 IC2.5
N$21
  Top 0.305: R7.1 IC2.23
N$22
  Top 0.305: 38.1,17.67 39.8,17.67 40.22,18.09 R3.1 | R24.2 24.06,27.68 24.06,19.61 26,17.67 38.1,17.67 | 38.1,17.67 38.1,16.7 T1.C
N$24
  Top 0.305: R21.1 IC2.17
N$25
  Top 0.305: R22.1 IC2.18
N$26
  Top 0.305: IC2.19 15.24,20.64 14.19,21.7 14.19,23.38 R23.1
N$27
  Top 0.305: R17.1 IC2.12
N$29
  Top 0.305: R4.1 27.73,13.64 27.88,13.5 T2.1
N$31
  Bottom 0.305: IC2.27 36.52,19.68 42.24,13.96 JP1.2
N$32
  Top 0.305: LED2.C 40.77,6.97 40.77,7.47 40.01,8.25 | LED1.C 39.23,6.97 39.23,7.47 40.01,8.25 | R5.2 40.01,8.25
N$34
  Top 0.305: T1.B 37.15,15.83 35.97,17.01 29.5,17.01 29.04,16.55 29.04,14.79 29.14,14.69 31.11,14.69 31.96,15.55 R1.2 R2.1
N$42
  Top 0.305: R8.1 IC2.24
N$43
  Top 0.305: 50.14,19.25 52.43,21.54 52.43,35.73 52.28,35.88 50.59,35.88 50.01,35.3 50.01,34.66 44.94,29.59 44.38,29.59 43.46,28.67 42.02,28.67 40.78,28.67 40.33,28.22 39.99,28.22 39.06,27.29 IC2.1 | START.2 50.16,17.89 50.14,17.91 50.14,19.25 | 50.14,19.25 | 50.14,19.25 46.99,22.4 46.99,22.85 R26.1
N$47  (via drill 0.35 pad 0.76)
  Top 0.305: R10.1 IC2.26 | LED2.A 44.68,7.98 43.96,7.98 v42.71,9.23
  Bottom 0.305: IC2.26 33.02,18.71 33.23,18.71 v42.71,9.23
N$48  (via drill 0.35 pad 0.76)
  Top 0.305: v34.02,6.97 34.42,6.97 LED1.A | R9.1 IC2.25
  Bottom 0.305: v34.02,6.97 34.02,15.17 30.48,18.71 IC2.25
OE  (via drill 0.35 pad 0.76)
  Top 0.305: 30.37,60.12 21.58,60.12 19.38,57.92 IC4.4 | 30.37,60.12 30.92,60.12 32.38,58.65 32.38,57.23 35.23,54.38 35.23,52.61 37.62,50.21 37.62,47.26 32.38,42.02 32.38,41.74 31.58,40.93 30.51,40.93 29.54,41.9 IC5.6 | v30.37,61.97 30.37,60.12 | SV2.6 37.77,34.91 34.27,31.42 R14.2 | IC9.8 33.66,72.69 31.11,70.15 IC8.12
  Bottom 0.305: IC5.6 29.54,41.9 32.34,39.1 39.29,39.1 40.31,38.09 | IC3.16 40.31,38.09 | SV2.6 38.73,35.88 40.31,37.45 40.31,38.09 | JP3.2 45.21,89.53 42.78,87.09 42.78,83.93 36.21,77.36 35.97,77.36 33.66,75.04 33.66,74.62 IC9.8 | v30.37,61.97 32.08,63.68 32.08,67.91 31.11,68.88 IC8.12
OE*  (via drill 0.35 pad 0.76)
  Top 0.305: IC16.27 67.33,85.02 69.28,83.07 v69.35,83.07 | IC15.11 81.55,54.41 80.89,55.07 74.58,55.07 73.66,54.16 IC14.6 73.66,53.24 73.66,52.4 66.79,52.4 64.28,54.91 64.28,56.99 | v82.55,86.28 86.39,86.28 87.48,87.36 IC11.32 | 64.28,56.99 | 64.28,56.99 SV1.6
  Bottom 0.305: v82.55,86.28 72.56,86.28 v69.35,83.07 69.35,80.59 66.85,78.09 66.85,66.91 61.52,61.59 SV1.6
PAG  (via drill 0.35 pad 0.76)
  Top 0.305: IC8.17 43.81,68.88 42.24,67.3 42.24,57.92 | IC4.13 42.24,57.92 | IC3.21 50.47,53.33 49.5,54.3 45.87,54.3 42.24,57.92 | IC6.3 20.32,87.9 21.02,87.2 25.35,87.2 27.3,85.25 27.3,84.98 29.2,83.09 30.66,83.09 32.23,81.52 32.23,80.56 36.11,76.68 v36.25,76.68 | R11.2 38.1,25.39 40.23,27.52 43.55,27.52 50.47,34.43 50.47,34.91 SV2.1
  Bottom 0.305: IC8.17 43.81,70.81 37.95,76.68 v36.25,76.68 | IC3.21 51.44,52.37 52.41,51.39 52.41,36.86 51.44,35.88 SV2.1
PAG*
  Top 0.305: 88.74,76.36 67.71,76.36 65.9,78.17 IC16.32 | 90,51.55 95.19,51.55 95.37,51.74 95.37,69.72 88.74,76.36 | SV1.1 87.33,48.88 90,51.55 | 88.74,76.36 97.94,85.56 97.94,88.96 IC11.11 | IC15.16 90,51.55
RDY  (via drill 0.35 pad 0.76)
  Top 0.305: v27.14,63.25 24.47,60.57 19.49,60.57 16.84,57.92 IC4.3 | 36.2,74.62 36.94,75.36 36.94,76.96 36.54,77.36 36.17,77.36 32.69,80.84 32.69,83.62 32.12,84.19 32.12,86.26 30.48,87.9 | IC5.3 21.92,41.9 24.77,39.05 24.77,37.99 25.64,37.12 36.79,37.12 37.77,38.09 IC3.15 | SV2.7 35.23,34.91 33.35,33.04 30.26,33.04 29.27,32.05 29.27,27.19 27.47,25.39 25.4,25.39 R7.2 | IC8.11 29.54,69.84 32.38,72.69 32.38,73.77 33.23,74.62 36.2,74.62 | IC6.2 17.78,91.15 20.74,91.15 21.59,90.3 21.59,88.7 22.39,87.9 30.48,87.9 | IC7.2 30.48,87.9 | IC9.9 36.2,74.62
  Bottom 0.305: IC3.15 37.77,38.09 37.77,37.45 36.2,35.88 SV2.7 | IC8.11 28.57,67.15 27.14,65.72 v27.14,63.25 | IC4.3 15.88,56.95 16.18,56.95 19.68,53.45 19.68,49.09 20.95,47.82 IC5.3
RDY*  (via drill 0.35 pad 0.76)
  Top 0.305: v68.87,84.44 67.51,85.8 66.8,85.8 IC16.26 | v87.41,55.39 86.24,55.39 86.06,55.21 IC15.10 | IC14.3 69.85,55.79 61.52,64.12 SV1.7 | v87.08,88.16 87.48,88.16 IC11.31
  Bottom 0.305: v87.41,55.39 87.41,87.84 v87.08,88.16 86.74,88.5 72.94,88.5 v68.87,84.44 68.65,84.22 68.65,80.68 65.15,77.17 65.15,67.76 61.52,64.12 SV1.7
V+
  Top 0.635: C1.+ 9.69,14.59 8.81,13.73 U$3.TIP | IC1.IN 30.48,4.4 31.71,4.4 32.52,5.2 32.52,6.28 31.83,6.97 29.23,6.97 28.49,7.72 28.49,8.83 32.18,12.52 33.02,12.52 | T1.E 37.84,12.28 33.26,12.28 33.02,12.52 | R1.1 33.02,12.52
  Bottom 0.635: IC1.IN 30.48,4.4 29.25,4.4 19.92,13.73 U$3.TIP
VCC
  Top 0.635: IC1.OUT 35.07,8.25 39.15,12.32 44.23,12.32 T3.E 45.4,14.66 46.17,15.43 46.17,19.71 44.24,21.63 44.13,21.63 R26.2 | C2.+ 22.25,14.59 22.25,15.59 18.91,18.94 18.91,19.68 IC2.20
  Bottom 0.635: IC2.20 17.78,20.8 22.86,25.88 22.86,26.16 | IC2.7 22.86,26.16 | IC1.OUT 30.48,9.48 29.25,10.71 29.25,20.01 23.09,26.16 22.86,26.16
WR  (via drill 0.35 pad 0.76)
  Top 0.305: 29.57,58.37 28.6,59.34 23.34,59.34 21.92,57.92 IC4.5 | 29.57,58.37 29.64,58.31 29.64,58.02 31.2,56.47 31.92,56.47 34.77,53.62 34.77,52.42 37.16,50.03 37.16,48.91 31.11,42.87 IC5.7 | v30.63,59.43 29.57,58.37 | IC8.13 34.62,69.84 35.84,71.06 37.51,71.06 39.72,73.27 39.72,86.39 39.1,87.02 39.1,91.98 35.56,95.52 IC7.11 | R16.2 25.4,32.38 26.98,33.95 31.52,33.95 32.23,34.66 32.23,34.91 33.22,35.89 39.33,35.89 40.31,34.91 SV2.5
  Bottom 0.305: IC9.1 15.88,72.69 16.84,71.72 16.84,63 20.95,58.88 IC4.5 | IC8.13 33.66,68.88 34.66,67.87 34.66,63.46 v30.63,59.43 | 42.85,38.09 41.38,39.56 34.42,39.56 32.08,41.9 IC5.7 | IC3.17 42.85,38.09 | SV2.5 41.27,35.88 42.85,37.45 42.85,38.09
WR*  (via drill 0.35 pad 0.76)
  Top 0.305: v88.75,85.97 88.85,85.87 IC11.1 | IC16.28 66.8,84.23 67,84.03 v67.2,84.03 | IC15.12 86.81,53.66 81.65,53.66 80.7,54.61 75.39,54.61 74.93,54.16 IC14.7 74.93,53.24 74.93,52.4 74.46,51.93 66.58,51.93 62.24,56.26 62.24,58.32 61.52,59.05 SV1.5
  Bottom 0.305: v88.75,85.97 88.75,87.55 87.33,88.96 72.13,88.96 v67.2,84.03 63.09,79.92 63.09,70.31 60.72,67.94 58.65,67.94 57.86,67.14 57.86,59.05 SV1.5
XA0
  Top 0.305: 37.21,67.76 37.62,67.76 38.73,68.88 IC8.15 38.73,70.32 38.73,70.81 42.27,74.34 42.27,85.99 42.22,86.05 42.22,94.55 43.18,95.52 IC7.8 | 37.21,67.76 24.17,67.76 22.27,69.65 22.27,70.76 19.38,73.65 IC9.2 | 37.21,67.76 37.21,59.9 36.2,58.88 IC4.11 36.2,56.95 37.77,55.38 37.77,52.28 39.7,50.35 39.7,46.26 | 39.7,46.26 39.76,46.26 47.93,38.09 IC3.19 | 39.7,46.26 39.59,46.26 36.2,42.87 IC5.9 | SV2.3 45.39,34.91 40.23,29.75 36.63,29.75 34.45,27.57 34.45,27.35 32.49,25.39 30.48,25.39 R9.2
  Bottom 0.305: IC3.19 47.93,38.09 47.93,37.45 46.35,35.88 SV2.3 | IC6.6 20.32,98.77 43.18,98.77 IC7.8
XA0*  (via drill 0.35 pad 0.76)
  Top 0.305: IC11.9 97,85.27 88.82,77.08 v67.99,77.08 67.77,77.08 66.67,78.19 66.67,80.31 66.8,80.45 66.8,82.65 IC16.30 | 77.47,52.4 76.08,51.02 64.47,51.02 61.52,53.96 SV1.3 | 77.47,52.4 78.79,51.08 87.93,51.08 88.41,51.55 IC15.14 | IC14.9 77.47,52.4
  Bottom 0.305: SV1.3 61.52,53.96 67.99,60.43 v67.99,77.08
XA1  (via drill 0.35 pad 0.76)
  Top 0.305: IC6.5 22.86,95.52 33.2,95.52 v35.01,93.71 | SV2.2 47.93,34.91 42.31,29.29 38.3,29.29 36.99,27.98 36.99,27.34 34.09,24.43 R10.2 | IC7.7 43.18,87.9 42.78,87.5 42.78,72.31 41.27,70.81 IC8.16 41.27,69.36 41.27,68.88 39.7,67.3 39.7,59.85 38.73,58.88 IC4.12 38.73,56.95 40.01,55.69 40.01,51.13 51.44,39.7 51.44,39.05 IC3.20
  Bottom 0.305: IC7.7 43.18,91.15 37.57,91.15 v35.01,93.71 | IC3.20 50.47,38.09 50.47,37.45 48.9,35.88 SV2.2
XA1*  (via drill 0.35 pad 0.76)
  Top 0.305: v83.83,85.59 87.41,85.59 88.46,86.65 89.07,86.65 90.58,88.16 96.06,88.16 IC11.10 | v69.88,74.37 69.04,74.37 65,78.41 65,81.87 IC16.31 | IC15.15 89.2,51.55 88.2,50.55 62.4,50.55 61.52,51.42 SV1.2
  Bottom 0.305: v83.83,85.59 72.6,74.37 v69.88,74.37 69.88,59.79 61.52,51.42 SV1.2
XTAL1
  Top 0.305: IC8.19 48.9,70.81 47.91,71.79 47.91,86.94 48.77,87.8 JP3.1 | R15.2 27.94,32.38 29.06,33.49 32.23,33.49 SV2.8
  Bottom 0.305: 35.12,70.81 34.92,70.81 32.08,73.65 IC9.7 | 35.12,70.81 39.19,70.81 40.01,69.99 40.01,69.72 40.86,68.86 46.95,68.86 47.93,69.84 IC8.19 | 35.12,70.81 35.12,62.89 31.11,58.88 IC4.9 31.11,56.95 30.15,55.99 30.15,52.49 27.57,49.91 27.57,44.4 26.04,42.87 IC5.5 27,41.9 28.91,39.99 30.79,39.99 32.69,38.09 IC3.13 SV2.8
XTAL1*  (via drill 0.35 pad 0.76)
  Top 0.305: 72.39,54.16 74.9,56.67 83.81,56.67 83.95,56.81 IC15.8 | IC14.5 72.39,54.16 | SV1.8 72.2,54.16 72.39,54.16 | 70.58,83.33 70.58,83.7 66.91,87.38 66.8,87.38 IC16.24 | v67.97,80.98 68.23,80.98 70.58,83.33 | 70.58,83.33 73.5,80.41 90.47,80.41 94.71,84.66 IC11.7
  Bottom 0.305: v67.97,80.98 64.69,77.71 64.69,69.84 61.52,66.67 SV1.8

## Text on the board
tPlace: Attiny11 | Attiny12 | Attiny85 | Attiny13 | Attiny44 | Attiny15 | Attiny24 | Attiny22 | Attiny25 | Attiny45 | Attiny85 | AVR | Atmega162 | atmega | Atmega8515 | Atmega8535 | Attiny26 | AT90s8515 | Attiny261 | AT90s8535 | Attiny461 | AT90s4414 | Attiny861 | AT90s4434 | HV | doctor | mega8,88,168... | diy.elektroda.eu | BS2 | PAG | diy.elektroda.eu | tiny2313... | mega16,32... | DA0 | . . . . . . . | DA7 | RES | +5V | GND | XTAL | RDY | OE | WR | BS1 | XA0 | XA1 | ALLOW | ERASE | 12V | BAD | GOOD | START
bPlace: AVR | atmega | HV | doctor
tNames: HVSP | MEGA8 | MEGA128 | HVPP | 1 | T2313 | MEGA16 | 1 | 1 | DIL28/3-DIL32 | DIL28/3-DIL28/6 | 7805
bNames: MISO | GND | SCK | GND | RST | GND | GND | MOSI | VCC